# Altium schematic sheet Camera-V1_0.SchDoc
size A4; Organization: VAEngineering; Address1: Rechtstro 1 bus 2; Address2: 9185 Wachtebeke; Address3: Belgium; Revision: REV0; SheetNumber: 1; SheetTotal: 5
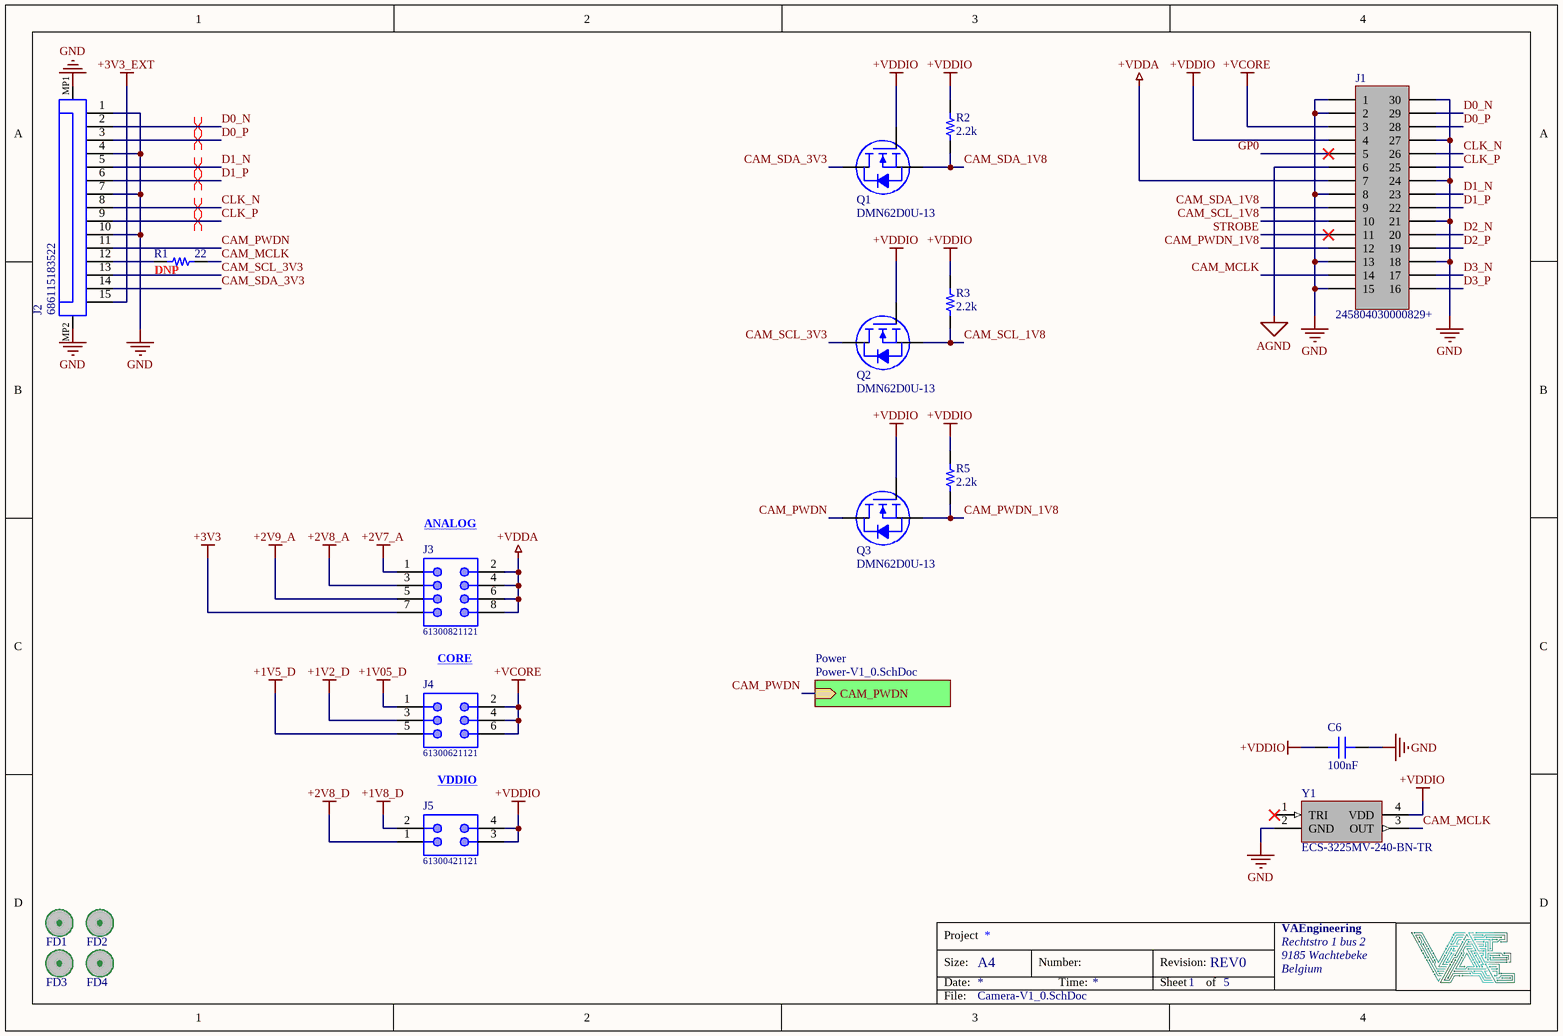
[diagram p0: Camera-V1_0.SchDoc]

## Parts
C6  Capacitance: 100nF  [Esmart C0603]  (hidden comment: CL10B104KB8NNNL)
FD1  Fiducial  [Fiducial 1]  (value not drawn)  (no BOM)
FD2  Fiducial  [Fiducial 1]  (value not drawn)  (no BOM)
FD3  Fiducial  [Fiducial 1]  (value not drawn)  (no BOM)
FD4  Fiducial  [Fiducial 1]  (value not drawn)  (no BOM)
J1  245804030000829+  [AVX 245804030000829+ - IMX477 - Reverse]
J2  686115183522  [WURTH 686115183522]
J3  61300821121  [Wurth 61300821121]
J4  61300621121  [Wurth 61300621121]
J5  61300421121  [Wurth 61300421121]
Q1  DMN62D0U-13  [Diodes SOT23 MOSFET]
Q2  DMN62D0U-13  [Diodes SOT23 MOSFET]
Q3  DMN62D0U-13  [Diodes SOT23 MOSFET]
R1  Resistance: 22  [ESmart R0603]  (hidden comment: RMCF0603JT22R0)
R2  Resistance: 2.2k  [ESmart R0603]  (hidden comment: RMCF0603FT2K20)
R3  Resistance: 2.2k  [ESmart R0603]  (hidden comment: RMCF0603FT2K20)
R5  Resistance: 2.2k  [ESmart R0603]  (hidden comment: RMCF0603FT2K20)
Y1  ECS-3225MV-240-BN-TR  [ECS ECS-3225MV]

## Sub-sheets
Power = Power-V1_0.SchDoc: CAM_PWDN (in)

## Nets
+1V2_D: J4.3
+1V05_D: J4.1
+1V5_D: J4.5
+1V8_D: J5.2
+2V7_A: J3.1
+2V8_A: J3.3
+2V8_D: J5.1
+2V9_A: J3.5
+3V3: J3.7
+3V3_EXT: J2.15
+VCORE: J1.3 J4.2 J4.4 J4.6
+VDDA: J1.7 J3.2 J3.4 J3.6 J3.8
+VDDIO: C6.2 J1.4 J5.3 J5.4 Q1.G Q2.G Q3.G R2.2 R3.2 R5.2 Y1.4(VDD)
AGND: J1.6
GND: C6.1 J1.1 J1.2 J1.8 J1.13 J1.15 J1.18 J1.21 J1.24 J1.27 J1.30 J2.1 J2.4 J2.7 J2.10 J2.MP1 J2.MP2 Y1.2(GND)
CAM_MCLK: J1.14 R1.2 Y1.3(OUT)
CAM_PWDN: J2.11 Q3.D ; sheet Power/CAM_PWDN
CAM_PWDN_1V8: J1.12 Q3.S R5.1
CAM_SCL_1V8: J1.10 Q2.S R3.1
CAM_SCL_3V3: J2.13 Q2.D
CAM_SDA_1V8: J1.9 Q1.S R2.1
CAM_SDA_3V3: J2.14 Q1.D
CLK_N: J1.26 J2.8
CLK_P: J1.25 J2.9
D0_N: J1.29 J2.2
D0_P: J1.28 J2.3
D1_N: J1.23 J2.5
D1_P: J1.22 J2.6
D2_N: J1.20
D2_P: J1.19
D3_N: J1.17
D3_P: J1.16
GP0: J1.5
STROBE: J1.11
NetJ2_12: J2.12 R1.1

Not connected (* = marked no-connect by the designer): Y1 1(TRI)*

## Layout directives
differential pair; differential pair class MIPI-D100; rule Differential Pairs Routing [Pref Gap = 0.125mm    Min Gap  = 0.125mm    Max Gap  = 0.125mmPref Width = 0.164mm    Min Width  = 0.164mm    Max Width  = 0.164mm]; rule Clearance Constraint [Generic clearance = 0.4mm, and 24 value(s) for objects]; rule Differential Pairs Routing [Pref Gap = 0.125mm    Min Gap  = 0.125mm    Max Gap  = 0.125mmPref Width = 0.164mm    Min Width  = 0.164mm    Max Width  = 0.164mm]: CLK_N, CLK_P, D0_N, D0_P, D1_N, D1_P

## Notes on the sheet
- (near R1) DNP
- (near J3) ANALOG
- CORE
- VDDIO
- Project
- Size:
- Date:
- A4
- Number:
- Time:
- Revision:
- Sheet
- of
- File:

## Library data of the parts
C6 = Samsung CL10B104KB8NNNL: CL10 Series 0603 0.1 uF 50 V ±10% Tolerance X7R Multilayer Ceramic Capacitor; Voltage Rating: 50V; Supplier 1: Digi-Key; Manufacturer: Samsung; Manufacturer Part Number: CL10B104KB8NNNL; RoHS: Yes; Category: Ceramic Capacitors; Stock 1: 359524; Pricing 1: 1=0,10000, 10=0,02900, 50=0,01580, 100=0,01280, 500=0,00916, 1000=0,00720, 2500=0,00654, 5000=0,00602 (USD); Mount: Surface Mount; Case/Package: 0603; Min Operating Temperature: -55°C; Max Operating Temperature: 125°C; Tolerance: 10%; Dielectric: X7R; Packaging: Tape and Reel; Package Quantity: 15000; Voltage Rating (DC): 50V; Length: 1.6mm; Width: 0.031inch; Height: 0.8mm; Thickness: 0.035inch; Depth: 0.8mm; Radiation Hardening: No; ComponentLink1URL: https://datasheet.ciiva.com/26838/getdatasheetpartid-357523-26838415.pdf?src-supplier=Verical; ComponentLink1Description: https://datasheet.ciiva.com/26838/getdatasheetpartid-357523-26838415.pdf?src-supplier=Verical; ComponentLink2URL: https://datasheet.ciiva.com/25741/cl10b104kb8nnnl-25741341.pdf?src-supplier=Digi-Key; ComponentLink2Description: https://datasheet.ciiva.com/25741/cl10b104kb8nnnl-25741341.pdf?src-supplier=Digi-Key; Supplier 2: Digi-Key; Stock 2: 359524; Pricing 2: 1=0,10000, 10=0,02900, 50=0,01580, 100=0,01280, 500=0,00916, 1000=0,00720, 2500=0,00654, 5000=0,00602 (USD); Supplier 3: Digi-Key; Stock 3: 359524; Pricing 3: 15000=0,00524, 30000=0,00497, 75000=0,00445, 105000=0,00360, 150000=0,00348, 375000=0,00314 (USD); Supplier 4: Future Electronics; Stock 4: 1530651; Pricing 4: 1=0,09800, 1000=0,01180, 2500=0,00890, 5000=0,00720, 10000=0,00580 (USD); Supplier 5: Future Electronics; Stock 5: 1530000; Pricing 5: 15000=0,00370, 45000=0,00310, 75000=0,00310, 225000=0,00300, 375000=0,00300 (USD); Supplier 6: Avnet; Stock 6: 1008000; Pricing 6: 15000=0,00264, 30000=0,00261, 60000=0,00259, 90000=0,00257, 120000=0,00255 (USD); Supplier 7: Mouser; Stock 7: 480000; Pricing 7: 15000=0,00500, 45000=0,00500 (USD); Supplier 8: Arrow Electronics; Stock 8: 180000; Pricing 8: 15000=0,00350, 1=0,02810, 10=0,02460, 25=0,02430, 100=0,02310, 250=0,02280, 500=0,02250, 1000=0,01640, 3000=0,01480, 6000=0,01360, 15000=0,00950 (USD); Supplier 9: Digi-Key; Supplier 10: Future Electronics; Supplier 11: Future Electronics; Supplier Part Number 1: 1276-CL10B104KB8NNNLCT-ND; Supplier Part Number 2: 1276-CL10B104KB8NNNLDKR-ND; Supplier Part Number 3: 1276-CL10B104KB8NNNLTR-ND; Supplier Part Number 4: 3113240; Supplier Part Number 5: 1051215; Supplier Part Number 6: CL10B104KB8NNNL; Supplier Part Number 7: 187-CL10B104KB8NNNL; Supplier Part Number 8: CL10B104KB8NNNL; Supplier Part Number 9: CL10B104KB8NNNL-ND; Supplier Part Number 10: CL10B104KB8NNNL-REEL; Supplier Part Number 11: CL10B104KB8NNNL-CUTT
FD1-FD4 = Fiducial: Manufacturer: /; id: 1; ManufacturerRef: Fiducial; Package: MSC_FIDUCIAL
J1 = AVX 245804030000829+: 30 Position .04 mm Pitch Microleaf Mezzanine Connector; Manufacturer: Kyocera AVX; Supplier 1: Digi-Key; Manufacturer Part Number: 245804030000829+; RoHS: Yes; Category: Headers and Wire Housings; Stock 1: 11955; Pricing 1: 1=0,83000, 10=0,69800, 25=0,66960, 50=0,65540, 100=0,62690, 250=0,56992, 500=0,51294, 1000=0,45595 (USD); RoHS Compliant: Yes; ComponentLink1URL: http://global.kyocera.com/prdct/electro/product/pdf/5804.pdf?src-supplier=Digi-Key; ComponentLink1Description: http://global.kyocera.com/prdct/electro/product/pdf/5804.pdf?src-supplier=Digi-Key; Supplier 2: Digi-Key; Stock 2: 9000; Pricing 2: 1=0,83000, 10=0,69800, 25=0,66960, 50=0,65540, 100=0,62690, 250=0,56992, 500=0,51294, 1000=0,45595, 3000=0,41321, 6000=0,39896, 9000=0,37996 (USD); Supplier 3: Digi-Key; Stock 3: 9000; Pricing 3: 3000=0,41321, 6000=0,39896, 9000=0,37996 (USD); Supplier 4: Mouser; Stock 4: 1221; Pricing 4: 1=1,53000, 10=1,40000, 20=1,36000, 50=1,31000, 100=1,22000, 200=1,07000, 500=1,02000, 1000=0,96600, 2000=0,90500, 10000=0,90500 (USD); Supplier 5: Avnet; Pricing 5: 6000=0,38539, 12000=0,37996, 18000=0,36910, 30000=0,36096, 60000=0,34739, 300000=0,33925, 600000=0,33111 (USD); Supplier 6: Future Electronics; Pricing 6: 3000=0,36500 (USD); Supplier 7: Newark; Supplier 8: Arrow Electronics; Supplier 9: Digi-Key; Supplier 10: Future Electronics; Supplier Part Number 1: 478-12013-1-ND; Supplier Part Number 2: 478-245804030000829+-ND; Supplier Part Number 3: 478-12013-2-ND; Supplier Part Number 4: 581-245804030000829+; Supplier Part Number 5: 245804030000829+; Supplier Part Number 6: 8075320; Supplier Part Number 7: 64W1792; Supplier Part Number 8: 245804030000829+; Supplier Part Number 9: 478-12013-6-ND; Supplier Part Number 10: 4098264
J2 = Wurth 686115183522: WR-FPC SMT ZIF Horizontal Bottom Contact Low Profile, pitch 1mm, 15p; Manufacturer: Wurth Elektronik; Contact Resistance: 30mOhm; Pin Number: 15; Working Voltage: 50VAC; Rated Current: 0.8A; ComponentLink1Description: Manufacturer; ComponentLink1URL: http://www.we-online.de; ComponentLink2Description: Datasheet; ComponentLink2URL: https://katalog.we-online.com/em/datasheet/686115183522.pdf; Packaging: Tape and Reel; Pitch: 1mm; Published Date: March 2021; Mounting Technology: SMT; Operating Temperature: -25 to +85degC; Length: 21.2mm; Manufacturer Part Number: 686115183522; Type: Horizontal; Supplier 1: Digi-Key; Supplier 2: Digi-Key; Supplier 3: Newark; Supplier 4: Mouser; Supplier 5: RSComponents; Supplier 6: Digi-Key; Supplier 7: Farnell; Supplier 8: RSComponents; Supplier 9: RSComponents; Supplier Part Number 1: 732-11331-1-ND; Supplier Part Number 2: 732-11331-6-ND; Supplier Part Number 3: 15AC9059; Supplier Part Number 4: 710-686115183522; Supplier Part Number 5: 1418556; Supplier Part Number 6: 732-11331-2-ND; Supplier Part Number 7: 2748985; Supplier Part Number 8: 1424133; Supplier Part Number 9: 1424133P
J3 = Wurth 61300821121: WR-PHD Pin Header, THT, pitch 2.54mm, Dual Row, Vertical, 8pin; Manufacturer: Wurth Electronics; Pin Number: 8; Gender: Male; Rated Current: 3A; Working Voltage: 250VAC; Withstanding Voltage: 500VAC; Contact Resistance: 20mOhm; Connector Type: Male Pin; Row Spacing: 0.1inch; ComponentLink1Description: Manufacturer; ComponentLink1URL: http://www.we-online.de; ComponentLink2Description: Datasheet; ComponentLink2URL: https://katalog.we-online.de/em/datasheet/6130xx21121.pdf; Part Number: 61300821121; Published Date: June 2019; Publisher: Wurth Elektronik; Pitch: 2.54mm; Operating Temperature: -40 to +105degC; Mounting Technology: THT; Packaging: Bag; Row Number: Dual; Orientation: Vertical; Supplier 1: Digi-Key; Manufacturer Part Number: 61300821121; Stock 1: 2816; Pricing 1: 1=0,66000, 10=0,55700, 25=0,46400, 50=0,38700, 100=0,35200, 1000=0,32000 (USD); RoHS: Yes; Mount: Through Hole; Contact Plating: Gold; Contact Material: Copper; Color: Black; Number of Rows: 2; Number of Positions: 8; Termination: Solder; Number of Contacts: 8; Contact Mating Length: 0.236inch; REACH SVHC: Unknown; Lead Free: Lead Free; ComponentLink3URL: https://datasheet.ciiva.com/28505/1442180-28505510.pdf?src-supplier=Element14; ComponentLink3Description: https://datasheet.ciiva.com/28505/1442180-28505510.pdf?src-supplier=Element14; Supplier 2: RSComponents; Stock 2: 270; Pricing 2: 5=0,58800, 125=0,30400, 500=0,28800, 2500=0,27400, 5000=0,26000 (EUR); Supplier 3: RSComponents; Stock 3: 20; Pricing 3: 125=0,30400, 500=0,28800, 2500=0,27400, 5000=0,26000 (EUR); Supplier 4: Mouser; Stock 4: 508; Pricing 4: 1=0,66000, 10=0,55700, 25=0,46400, 50=0,38700, 100=0,35200, 1000=0,32000, 10000=0,32000 (USD); Supplier 5: Newark; Stock 5: 2004; Pricing 5: 1=0,66000, 10=0,55700, 25=0,46400, 50=0,38700, 100=0,35200, 500=0,33600, 1000=0,32000 (USD); Supplier Part Number 1: 732-5296-ND; Supplier Part Number 2: 8281525; Supplier Part Number 3: 8281525P; Supplier Part Number 4: 710-61300821121; Supplier Part Number 5: 20X0965
J4 = Wurth 61300621121: WURTH ELEKTRONIK         61300621121            Board-To-Board Connector, Vertical, WR-PHD Series, Through Hole, Header, 6 Contacts, 2.54 mm; Manufacturer: Wurth Electronics; Pin Number: 6; Pitch: 2.54 mm; Gender: Male; Rated Current: 3 A; Working Voltage: 250 VAC; Withstanding Voltage: 500 VAC; Contact Resistance: 20 mOhm; Row Number: Dual; Connector Type: Male Pin; Row Spacing: 0.1inch; ComponentLink1Description: Manufacturer; ComponentLink1URL: http://www.we-online.de; ComponentLink2Description: Datasheet; ComponentLink2URL: https://katalog.we-online.de/em/datasheet/6130xx21121.pdf; Part Number: 61300621121; Published Date: August 2018; Publisher: Wurth Elektronik; Operating Temperature: -40 to 105 degC; Mounting Technology: THT; Packaging: Bag; Orientation: Vertical; Supplier 1: Digi-Key; Manufacturer Part Number: 61300621121; RoHS: Yes; Category: Connectors; Stock 1: 2352; Pricing 1: 1=0,54000, 10=0,45400, 25=0,37920, 50=0,31600, 100=0,28700, 1000=0,26100 (USD); Mount: Through Hole; Contact Plating: Gold; Contact Material: Copper; Color: Black; Number of Rows: 2; Number of Positions: 6; Termination: Solder; Number of Contacts: 6; Contact Mating Length: 0.236inch; REACH SVHC: Unknown; ComponentLink3URL: https://datasheet.ciiva.com/28505/1442180-28505463.pdf?src-supplier=Element14; ComponentLink3Description: https://datasheet.ciiva.com/28505/1442180-28505463.pdf?src-supplier=Element14; Supplier 2: Farnell; Stock 2: 2642; Pricing 2: 10=0,28200, 100=0,25700, 500=0,25400, 1000=0,25000, 2500=0,24500, 5000=0,24000 (EUR); Supplier 3: Mouser; Stock 3: 1757; Pricing 3: 1=0,54000, 10=0,45400, 25=0,37900, 50=0,31600, 100=0,28700, 250=0,28700 (USD); Supplier 4: RSComponents; Stock 4: 240; Pricing 4: 5=0,48000, 125=0,25400, 500=0,24200, 2500=0,23000, 5000=0,21800 (EUR); Supplier 5: RSComponents; Stock 5: 240; Pricing 5: 125=0,25400, 500=0,24200, 2500=0,23000, 5000=0,21800 (EUR); Supplier 6: RSComponents; Pricing 6: 1000=0,24700 (EUR); Supplier 7: Newark; Stock 7: 1000; Pricing 7: 1=0,17900, 10=0,17900, 25=0,17900, 50=0,17900, 100=0,17900, 500=0,17900, 1000=0,17900 (USD); Supplier Part Number 1: 732-5295-ND; Supplier Part Number 2: 2356131; Supplier Part Number 3: 710-61300621121; Supplier Part Number 4: 8281522; Supplier Part Number 5: 8281522P; Supplier Part Number 6: 1635258; Supplier Part Number 7: 20X0959
J5 = Wurth 61300421121: THT Vertical Pin Header WR-PHD, Pitch 2.54 mm, Dual Row, 4 pins; Manufacturer: Wurth Electronics; Pin Number: 4; Pitch: 2.54 mm; Gender: Male; Rated Current: 3 A; Working Voltage: 250 VAC; Withstanding Voltage: 500 VAC; Contact Resistance: 20 mOhm; Connector Type: Male Pin; Row Spacing: 0.1inch; ComponentLink1Description: Manufacturer; ComponentLink1URL: http://www.we-online.de; ComponentLink2Description: Datasheet; ComponentLink2URL: https://katalog.we-online.de/em/datasheet/6130xx21121.pdf; Part Number: 61300421121; Published Date: August 2018; Publisher: Wurth Elektronik; Operating Temperature: -40 to 105 degC; Mounting Technology: THT; Packaging: Bag; Row Number: Dual; Orientation: Vertical; Supplier 1: Digi-Key; Manufacturer Part Number: 61300421121; Stock 1: 5126; Pricing 1: 1=0,45000, 10=0,38500, 25=0,32120, 50=0,26700, 100=0,24300, 1000=0,22100 (USD); RoHS: Yes; Mount: Through Hole; Contact Plating: Gold; Contact Material: Copper; Color: Black; Number of Rows: 2; Number of Positions: 4; Termination: Solder; Number of Contacts: 4; Contact Mating Length: 0.236inch; REACH SVHC: Unknown; Lead Free: Lead Free; ComponentLink3URL: https://datasheet.ciiva.com/28505/1442180-28505404.pdf?src-supplier=Element14; ComponentLink3Description: https://datasheet.ciiva.com/28505/1442180-28505404.pdf?src-supplier=Element14; Supplier 2: Farnell; Stock 2: 7099; Pricing 2: 10=0,23900, 100=0,21700, 500=0,21400, 1000=0,21000, 2500=0,20600, 5000=0,20200 (EUR); Supplier 3: Mouser; Stock 3: 2729; Pricing 3: 1=0,45000, 10=0,38500, 25=0,32100, 50=0,26700, 100=0,24300, 1000=0,22100, 10000=0,22100 (USD); Supplier 4: RSComponents; Stock 4: 155; Pricing 4: 5=0,45200, 125=0,22000, 500=0,19600, 2500=0,17600, 5000=0,15800 (EUR); Supplier 5: RSComponents; Stock 5: 155; Pricing 5: 125=0,22000, 500=0,19600, 2500=0,17600, 5000=0,15800 (EUR); Supplier 6: Newark; Stock 6: 6319; Pricing 6: 10=0,38500, 25=0,32100, 30=0,32100, 50=0,26700, 100=0,24300, 500=0,23200, 1000=0,22100 (USD); Supplier Part Number 1: 732-5294-ND; Supplier Part Number 2: 2356130; Supplier Part Number 3: 710-61300421121; Supplier Part Number 4: 8281513; Supplier Part Number 5: 8281513P; Supplier Part Number 6: 20X0953
Q1-Q3 = Diodes DMN62D0U-13: Trans MOSFET N-CH 60V 0.38A Automotive 3-Pin SOT-23 T/R; Manufacturer: Diodes; Alternative MPN1: DMG2302UK-7; Continuous Drain Current (ID): 380mA; Rds On Max: 2R; Input Capacitance: 32pF; Max Power Dissipation: 380mW; Supplier 1: Digi-Key; Manufacturer Part Number: DMN62D0U-13; RoHS: Yes; Category: MOSFETs; Stock 1: 129536; Pricing 1: 1=0,31000, 10=0,25000, 25=0,20920, 100=0,10220, 500=0,08526, 1000=0,05924, 2500=0,05506, 5000=0,04762 (USD); Mount: Surface Mount; Case/Package: TO-236-3; Number of Pins: 3; Min Operating Temperature: -55°C; Max Operating Temperature: 150°C; Packaging: Tape and Reel; Drain to Source Voltage (Vdss): 60V; ComponentLink1URL: http://www.farnell.com/datasheets/2814415.pdf?src-supplier=Farnell; ComponentLink1Description: http://www.farnell.com/datasheets/2814415.pdf?src-supplier=Farnell; ComponentLink2URL: http://www.mouser.com/ds/2/115/DMN62D0U-767517.pdf?src-supplier=Mouser; ComponentLink2Description: http://www.mouser.com/ds/2/115/DMN62D0U-767517.pdf?src-supplier=Mouser; ComponentLink3URL: https://www.diodes.com/assets/Datasheets/DMN62D0U.pdf?src-supplier=Digi-Key; ComponentLink3Description: https://www.diodes.com/assets/Datasheets/DMN62D0U.pdf?src-supplier=Digi-Key; ComponentLink4URL: http://www.farnell.com/datasheets/2814415.pdf?src-supplier=Newark; ComponentLink4Description: http://www.farnell.com/datasheets/2814415.pdf?src-supplier=Newark; Supplier 2: Digi-Key; Stock 2: 129536; Pricing 2: 1=0,31000, 10=0,25000, 25=0,20920, 100=0,10220, 250=0,10060, 500=0,08526, 1000=0,05924, 2500=0,05506, 5000=0,04762 (USD); Supplier 3: Digi-Key; Stock 3: 120000; Pricing 3: 10000=0,03949, 30000=0,03879, 50000=0,03485, 100000=0,03090, 250000=0,03020 (USD); Supplier 4: Newark; Stock 4: 11477; Pricing 4: 1=0,03800, 10=0,03800, 25=0,03800, 50=0,03800, 100=0,03800, 250=0,03800, 500=0,03800, 1000=0,03800 (USD); Supplier 5: Arrow Electronics; Stock 5: 109000; Pricing 5: 1=0,26970, 10=0,18100, 100=0,08690, 500=0,07360, 1000=0,04170, 10000=0,03250, 30000=0,03160, 50000=0,02870, 100000=0,02690, 250000=0,02630, 10000=0,02110, 30000=0,02080, 50000=0,01830, 100000=0,01720, 250000=0,01680, 1=0,17820, 10=0,15700, 25=0,15280, 100=0,08380, 250=0,08290, 500=0,07180, 1000=0,04740, 3000=0,04690, 6000=0,04650 (USD); Supplier 6: Mouser; Stock 6: 30973; Pricing 6: 1=0,31000, 10=0,20800, 100=0,10000, 500=0,08500, 1000=0,05900, 2500=0,04800 (USD); Supplier 7: Newark; Pricing 7: 10000=0,02700, 20000=0,02600, 40000=0,02500, 60000=0,02400, 100000=0,02300 (USD); Supplier 8: Avnet; Pricing 8: 1=0,32500, 10=0,22600, 25=0,18400, 50=0,14100, 100=0,09900 (USD); Supplier 9: Avnet; Pricing 9: 10000=0,03817, 20000=0,03714, 40000=0,03710, 60000=0,03218, 80000=0,03213 (USD); Supplier 10: Farnell; Stock 10: 5162; Pricing 10: 5=0,19700, 25=0,19100, 100=0,07830, 250=0,07220, 500=0,07190, 1000=0,03770, 5000=0,03700 (GBP); Supplier 11: Farnell; Pricing 11: 10=0,19700, 25=0,19100, 100=0,07830, 250=0,07220, 500=0,07190, 1000=0,03770, 5000=0,03700 (GBP); Supplier Part Number 1: DMN62D0U-13DICT-ND; Supplier Part Number 2: DMN62D0U-13DIDKR-ND; Supplier Part Number 3: DMN62D0U-13DITR-ND; Supplier Part Number 4: 07AH3790; Supplier Part Number 5: DMN62D0U-13; Supplier Part Number 6: 621-DMN62D0U-13; Supplier Part Number 7: 38AH7803; Supplier Part Number 8: 07AH3790; Supplier Part Number 9: DMN62D0U-13; Supplier Part Number 10: 3127350; Supplier Part Number 11: 3127350RL
R1 = Stackpole RMCF0603JT22R0: RES 22 OHM 5% 1/10W 0603; Manufacturer: Stackpole Electronics; Power Rating: 100mW; Temperature Coefficient: 100ppm/°C; Supplier 1: Digi-Key; Manufacturer Part Number: RMCF0603JT22R0; RoHS: Yes; Category: Chip SMD Resistors; Stock 1: 246248; Pricing 1: 1=0,10000, 10=0,01400, 100=0,00580, 1000=0,00262, 2500=0,00228 (USD); Mount: Surface Mount; Case/Package: 0603; Case Code (Metric): 1608; Case Code (Imperial): 0603; Contact Plating: Tin,Matte; Size Code: 0603; Min Operating Temperature: -55°C; Max Operating Temperature: 155°C; Tolerance: 5%; Packaging: Tape and Reel; Resistor Type: Thick Film; Number of Terminations: 2; Max Power Dissipation: 100mW; Features: Automotive AEC-Q200; Series: RMCF; Length: 0.061inch; Width: 0.031inch; Height: 0.022inch; Radiation Hardening: No; Lead Free: Lead Free; RoHS Compliant: Yes; ComponentLink1URL: http://components.arrow.com/part/dataview/50568178S380742N1174?src-supplier=Arrow+Electronics; ComponentLink1Description: http://components.arrow.com/part/dataview/50568178S380742N1174?src-supplier=Arrow+Electronics; ComponentLink2URL: https://www.seielect.com/catalog/SEI-Packaging.pdf?src-supplier=Digi-Key; ComponentLink2Description: https://www.seielect.com/catalog/SEI-Packaging.pdf?src-supplier=Digi-Key; ComponentLink3URL: http://www.seielect.com/catalog/sei-rmc.pdf?src-supplier=Future+Electronics; ComponentLink3Description: http://www.seielect.com/catalog/sei-rmc.pdf?src-supplier=Future+Electronics; ComponentLink4URL: https://www.seielect.com/catalog/SEI-RMCF_RMCP.pdf?src-supplier=Avnet; ComponentLink4Description: https://www.seielect.com/catalog/SEI-RMCF_RMCP.pdf?src-supplier=Avnet; ComponentLink5URL: https://www.seielect.com/catalog/SEI-RMCF_RMCP.pdf?src-supplier=Avnet+Asia; ComponentLink5Description: https://www.seielect.com/catalog/SEI-RMCF_RMCP.pdf?src-supplier=Avnet+Asia; Supplier 2: Digi-Key; Stock 2: 246248; Pricing 2: 1=0,10000, 10=0,01400, 100=0,00580, 1000=0,00262, 2500=0,00228 (USD); Supplier 3: Digi-Key; Stock 3: 245000; Pricing 3: 5000=0,00188, 10000=0,00163, 25000=0,00144, 50000=0,00132, 125000=0,00129 (USD); Supplier 4: Future Electronics; Stock 4: 2482; Pricing 4: 1=0,09800, 50=0,01930, 100=0,01450, 500=0,00740, 1500=0,00470 (USD); Supplier 5: Arrow Electronics; Stock 5: 10000; Pricing 5: 5000=0,00130, 500000=0,00120, 1=0,01460, 25=0,01450, 100=0,00500, 500=0,00330 (USD); Supplier 6: Newark; Pricing 6: 5000=0,00300, 50000=0,00200 (USD); Supplier 7: Avnet; Pricing 7: 5000=0,00128, 10000=0,00126, 20000=0,00122, 30000=0,00120, 40000=0,00115, 50000=0,00113, 500000=0,00110 (USD); Supplier 8: Future Electronics; Pricing 8: 5000=0,00370, 15000=0,00310, 25000=0,00310, 75000=0,00300, 125000=0,00300 (USD); Supplier 9: Digi-Key; Supplier 10: Future Electronics; Supplier 11: Future Electronics; Supplier Part Number 1: RMCF0603JT22R0CT-ND; Supplier Part Number 2: RMCF0603JT22R0DKR-ND; Supplier Part Number 3: RMCF0603JT22R0TR-ND; Supplier Part Number 4: 2113254; Supplier Part Number 5: RMCF0603JT22R0; Supplier Part Number 6: 32AC2627; Supplier Part Number 7: RMCF0603JT22R0; Supplier Part Number 8: 5190178; Supplier Part Number 9: RMCF0603JT22R0-ND; Supplier Part Number 10: RMCF0603JT22R0-CUTT; Supplier Part Number 11: RMCF0603JT22R0-REEL
R2 R3 R5 = Stackpole RMCF0603FT2K20: RES 2.2K OHM 1% 1/10W 0603; Manufacturer: Stackpole Electronics; Power Rating: 100mW; Temperature Coefficient: 100ppm/°C; Supplier 1: Digi-Key; Manufacturer Part Number: RMCF0603FT2K20; RoHS: Yes; Category: Chip SMD Resistors; Stock 1: 288002; Pricing 1: 1=0,10000, 10=0,01500, 100=0,00590, 1000=0,00265, 2500=0,00230 (USD); Mount: Surface Mount; Case/Package: 0603; Case Code (Metric): 1608; Case Code (Imperial): 0603; Contact Plating: Tin,Matte; Min Operating Temperature: -55°C; Max Operating Temperature: 155°C; Features: Automotive AEC-Q200; Resistor Type: Thick Film; Number of Terminations: 2; Tolerance: 1%; Packaging: Tape and Reel; Max Power Dissipation: 100mW; Length: 0.061inch; Width: 0.031inch; Height: 0.022inch; Radiation Hardening: No; Lead Free: Lead Free; ComponentLink1URL: http://components.arrow.com/part/dataview/46931077S7088098N1174?src-supplier=Arrow+Electronics; ComponentLink1Description: http://components.arrow.com/part/dataview/46931077S7088098N1174?src-supplier=Arrow+Electronics; ComponentLink2URL: https://www.seielect.com/catalog/SEI-RMCF_RMCP.pdf?src-supplier=Avnet+Asia; ComponentLink2Description: https://www.seielect.com/catalog/SEI-RMCF_RMCP.pdf?src-supplier=Avnet+Asia; ComponentLink3URL: https://www.seielect.com/catalog/SEI-RMCF_RMCP.pdf?src-supplier=Avnet; ComponentLink3Description: https://www.seielect.com/catalog/SEI-RMCF_RMCP.pdf?src-supplier=Avnet; ComponentLink4URL: https://www.seielect.com/catalog/SEI-Packaging.pdf?src-supplier=Digi-Key; ComponentLink4Description: https://www.seielect.com/catalog/SEI-Packaging.pdf?src-supplier=Digi-Key; ComponentLink5URL: http://www.seielect.com/Catalog/SEI-rmc.pdf?src-supplier=Future+Electronics; ComponentLink5Description: http://www.seielect.com/Catalog/SEI-rmc.pdf?src-supplier=Future+Electronics; Supplier 2: Digi-Key; Stock 2: 288002; Pricing 2: 1=0,10000, 10=0,01500, 100=0,00590, 1000=0,00265, 2500=0,00230 (USD); Supplier 3: Digi-Key; Stock 3: 285000; Pricing 3: 5000=0,00190, 10000=0,00165, 25000=0,00145, 50000=0,00136 (USD); Supplier 4: Avnet; Stock 4: 15000; Pricing 4: 5000=0,00220, 10000=0,00218, 20000=0,00216, 30000=0,00214, 40000=0,00212 (USD); Supplier 5: Arrow Electronics; Stock 5: 5000; Pricing 5: 5000=0,00200, 10000=0,00160, 1=0,02480, 10=0,01110, 25=0,00950 (USD); Supplier 6: Future Electronics; Pricing 6: 5000=0,00260, 20000=0,00220, 75000=0,00210, 200000=0,00210, 500000=0,00210 (USD); Supplier Part Number 1: RMCF0603FT2K20CT-ND; Supplier Part Number 2: RMCF0603FT2K20DKR-ND; Supplier Part Number 3: RMCF0603FT2K20TR-ND; Supplier Part Number 4: RMCF0603FT2K20; Supplier Part Number 5: RMCF0603FT2K20; Supplier Part Number 6: 7001095
Y1 = ECS-3225MV-240-BN-TR: Oscillator XO 24MHz ±50ppm 15pF HCMOS 55% 1.8V/2.5V/3.3V 4-Pin Mini-CSMD T/R; Manufacturer: ECS International; Supplier 1: Arrow Electronics; Manufacturer Part Number: ECS-3225MV-240-BN-TR; RoHS: Yes; Category: Oscillators; Stock 1: 261; Pricing 1: 1=1,1185, 10=0,9262, 50=0,9036, 100=0,7955, 500=0,7519, 1000=0,6177 (USD); ComponentLink1URL: https://www.ecsxtal.com/store/pdf/ECS-3225MV.pdf?src-supplier=Digi-Key; ComponentLink1Description: https://www.ecsxtal.com/store/pdf/ECS-3225MV.pdf?src-supplier=Digi-Key; ComponentLink2URL: https://ecsxtal.com/store/pdf/ECS-3225MV.pdf?src-supplier=Digi-Key; ComponentLink2Description: https://ecsxtal.com/store/pdf/ECS-3225MV.pdf?src-supplier=Digi-Key; ComponentLink3URL: https://datasheet.octopart.com/ECS-3225MV-240-BN-TR-ECS-International-datasheet-138123784.pdf?src-supplier=Future+Electronics; ComponentLink3Description: https://datasheet.octopart.com/ECS-3225MV-240-BN-TR-ECS-International-datasheet-138123784.pdf?src-supplier=Future+Electronics; ComponentLink4URL: https://datasheet.octopart.com/ECS-3225MV-240-BN-TR-ECS-International-datasheet-163697695.pdf?src-supplier=Master+Electronics; ComponentLink4Description: https://datasheet.octopart.com/ECS-3225MV-240-BN-TR-ECS-International-datasheet-163697695.pdf?src-supplier=Master+Electronics; Supplier 2: Avnet; Stock 2: 150000; Pricing 2: 1000=0,713 (USD); Supplier 3: Digi-Key; Stock 3: 35900; Pricing 3: 1=1,12, 10=0,988, 50=0,9238, 100=0,8164, 500=0,77344 (USD); Supplier 4: Digi-Key; Stock 4: 35900; Pricing 4: 1=1,12, 10=0,988, 50=0,9238, 100=0,8164, 500=0,77344 (USD); Supplier 5: Digi-Key; Stock 5: 35000; Pricing 5: 1000=0,64454, 3000=0,62306, 5000=0,60157, 10000=0,58009 (USD); Supplier 6: Future Electronics; Stock 6: 1000; Pricing 6: 1000=0,64, 2000=0,625, 3000=0,615, 4000=0,605 (USD); Supplier 7: Farnell; Stock 7: 427; Pricing 7: 1=1,12, 50=0,996, 100=0,871, 250=0,848, 500=0,825, 1000=0,809, 5000=0,792, 10000=0,776 (EUR); Supplier 8: Farnell; Stock 8: 427; Pricing 8: 100=0,871, 250=0,848, 500=0,825, 1000=0,809, 5000=0,792, 10000=0,776 (EUR); Supplier 9: Mouser; Stock 9: 4651; Pricing 9: 1=1,12, 10=0,924, 50=0,924, 100=0,817, 1000=0,644, 10000=0,58 (USD); Supplier 10: Newark; Stock 10: 427; Pricing 10: 1=1,14, 10=0,942, 25=0,906, 50=0,87, 100=0,833, 250=0,812, 500=0,789 (USD); Supplier Part Number 1: ECS-3225MV-240-BN-TR; Supplier Part Number 2: ECS-3225MV-240-BN-TR; Supplier Part Number 3: XC2876CT-ND; Supplier Part Number 4: XC2876DKR-ND; Supplier Part Number 5: XC2876TR-ND; Supplier Part Number 6: 9119217; Supplier Part Number 7: 4059327; Supplier Part Number 8: 4059327RL; Supplier Part Number 9: 520-3225MV-240-BNT; Supplier Part Number 10: 57AK3064